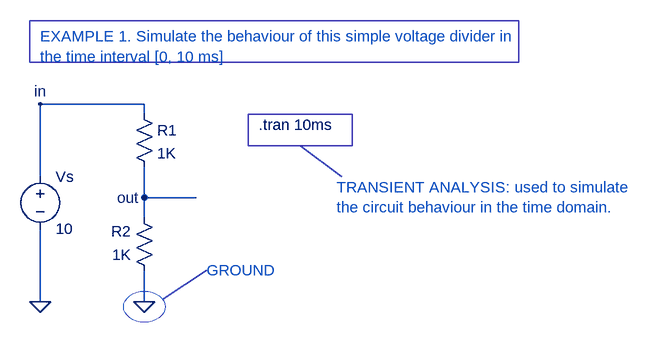
[diagram p0: schematic example-001.asc]
example-001.asc, the LTspice schematic file:
Version 4
SHEET 1 1472 680
WIRE 304 128 144 128
WIRE 304 144 304 128
WIRE 144 240 144 128
WIRE 304 272 304 224
WIRE 384 272 304 272
WIRE 304 304 304 272
WIRE 144 432 144 320
WIRE 304 432 304 384
FLAG 304 432 0
FLAG 144 432 0
FLAG 144 128 in
FLAG 304 272 out
SYMBOL voltage 144 224 R0
SYMATTR InstName Vs
SYMATTR Value 10
SYMBOL Res 320 400 R180
WINDOW 0 36 76 Left 2
WINDOW 3 36 40 Left 2
SYMATTR InstName R2
SYMATTR Value 1K
SYMBOL Res 288 128 R0
SYMATTR InstName R1
SYMATTR Value 1K
TEXT 144 24 Left 2 ;EXAMPLE 1. Simulate the behaviour of this simple voltage divider in\nthe time interval [0, 10 ms]
TEXT 400 384 Left 2 ;GROUND
TEXT 480 160 Left 2 !.tran 10ms
TEXT 600 256 Left 2 ;TRANSIENT ANALYSIS: used to simulate \nthe circuit behaviour in the time domain.
LINE Normal 400 384 332 428
LINE Normal 544 192 608 240
RECTANGLE Normal 128 0 880 64
RECTANGLE Normal 464 144 624 192
CIRCLE Normal 272 416 336 464 2

The netlist it stands for:
* example-001.asc
Vs in 0 10
R2 0 out 1K
R1 in out 1K
* EXAMPLE 1. Simulate the behaviour of this simple voltage divider in
* the time interval [0, 10 ms]
* GROUND
.tran 10ms
* TRANSIENT ANALYSIS: used to simulate
* the circuit behaviour in the time domain.
.backanno
.end